# Altium schematic sheet top.SchDoc
size A4; Author: Ben De Lathouwer; CompanyName: Eurocircuits; DrawnBy: Ben De Lathouwer; SheetNumber: 1; SheetTotal: 8
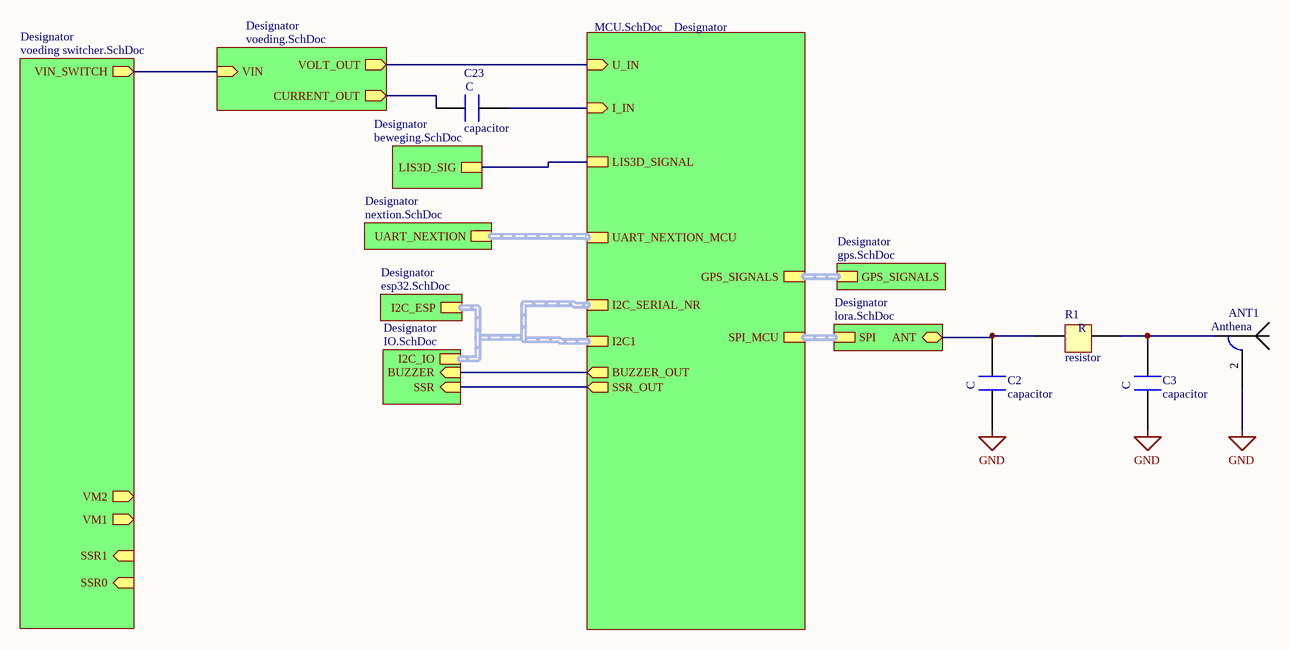
[diagram p0: top.SchDoc]

## Parts
ANT1  Anthena  [sma connector]
C2  capacitor  [0603]
C3  capacitor  [0603]
C23  capacitor  [0603]
R1  resistor  [0603]

## Sub-sheets
Designator = voeding.SchDoc: VIN (in), VOLT_OUT (out), CURRENT_OUT (out)
Designator = beweging.SchDoc: LIS3D_SIG (harness LIS3D_SIGNAL)
Designator = IO.SchDoc: SSR (in), BUZZER (in), I2C_IO (harness I2C_SERIAL_NR)
Designator = gps.SchDoc: GPS_SIGNALS (harness GPS_SIGNALS)
Designator = esp32.SchDoc: I2C_ESP (harness I2C1)
Designator = lora.SchDoc: ANT (bidir), SPI (harness SPI)
Designator = nextion.SchDoc: UART_NEXTION (harness UART_NEXTION)
Designator = MCU.SchDoc: GPS_SIGNALS (harness GPS_SIGNALS), LIS3D_SIGNAL (harness LIS3D_SIGNAL), I2C_SERIAL_NR (harness I2C_SERIAL_NR), I2C1 (harness I2C1), SPI_MCU (harness SPI), UART_NEXTION_MCU (harness UART_NEXTION), I_IN (in), U_IN (in), SSR_OUT (out), BUZZER_OUT (out)
Designator = voeding switcher.SchDoc: VM2 (out), VM1 (out), SSR1 (in), SSR0 (in), VIN_SWITCH (out)

## Nets
GND: ANT1.2 C2.2 C3.2
NetANT1_1: ANT1.1 C3.1 R1.1
NetC2_1: C2.1 R1.2 ; sheet Designator/ANT
NetC23_1: C23.1 ; sheet Designator/I_IN
NetC23_2: C23.2 ; sheet Designator/CURRENT_OUT
(unnamed): sheet Designator/VIN, sheet Designator/VIN_SWITCH
(unnamed): sheet Designator/VOLT_OUT, sheet Designator/U_IN
(unnamed): sheet Designator/SSR, sheet Designator/SSR_OUT
(unnamed): sheet Designator/BUZZER, sheet Designator/BUZZER_OUT

## Buses and harness runs
harness sheet Designator/I2C1 = sheet Designator/I2C_ESP = sheet Designator/I2C_IO = sheet Designator/I2C_SERIAL_NR
harness sheet Designator/SPI = sheet Designator/SPI_MCU
harness sheet Designator/UART_NEXTION = sheet Designator/UART_NEXTION_MCU

## Notes on the sheet
- (in symbol capacitor) C
- (in symbol resistor) R